# Altium schematic sheet P03 Power Tree.SchDoc
size 297 x 209 mm
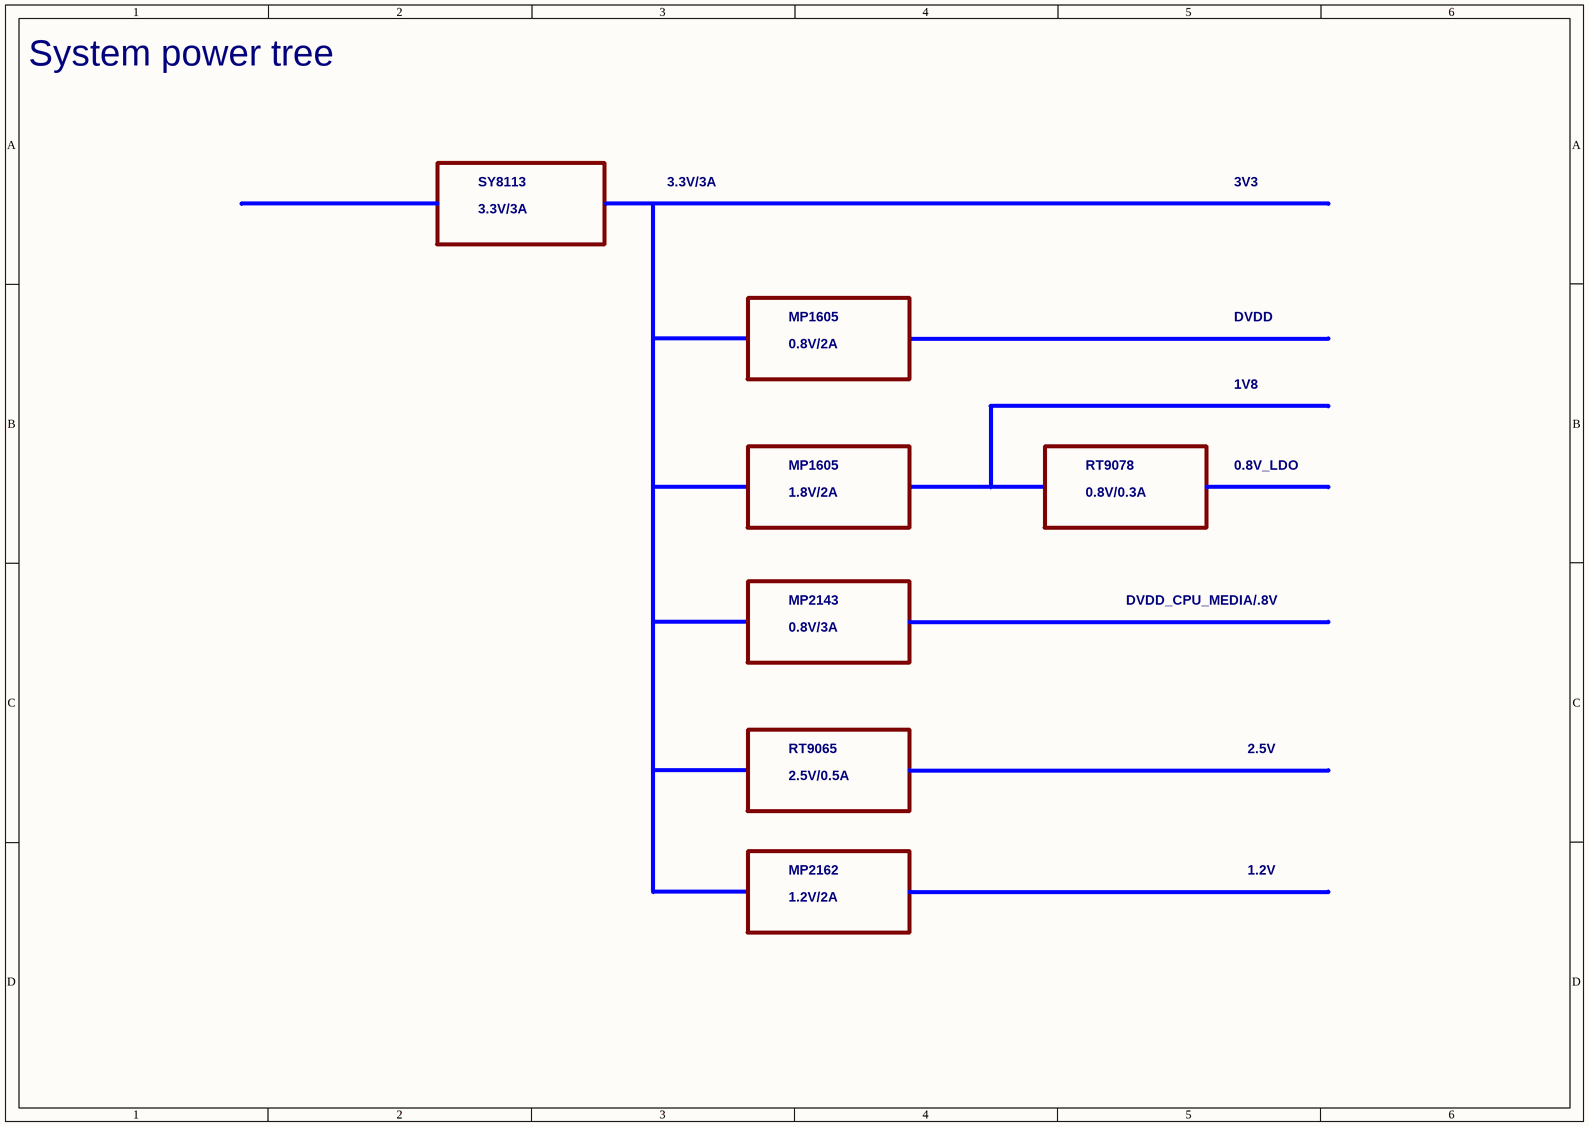
[diagram p0: P03 Power Tree.SchDoc]

## Notes on the sheet
- System power tree
- SY8113
- 3.3V/3A
- 3V3
- MP1605
- DVDD
- 0.8V/2A
- 1V8
- RT9078
- 0.8V_LDO
- 1.8V/2A
- 0.8V/0.3A
- MP2143
- DVDD_CPU_MEDIA/.8V
- 0.8V/3A
- RT9065
- 2.5V/0.5A
- 2.5V
- MP2162
- 1.2V
- 1.2V/2A